# EAGLE schematic Chamber VIP_2 (EAGLE 7.6.0)
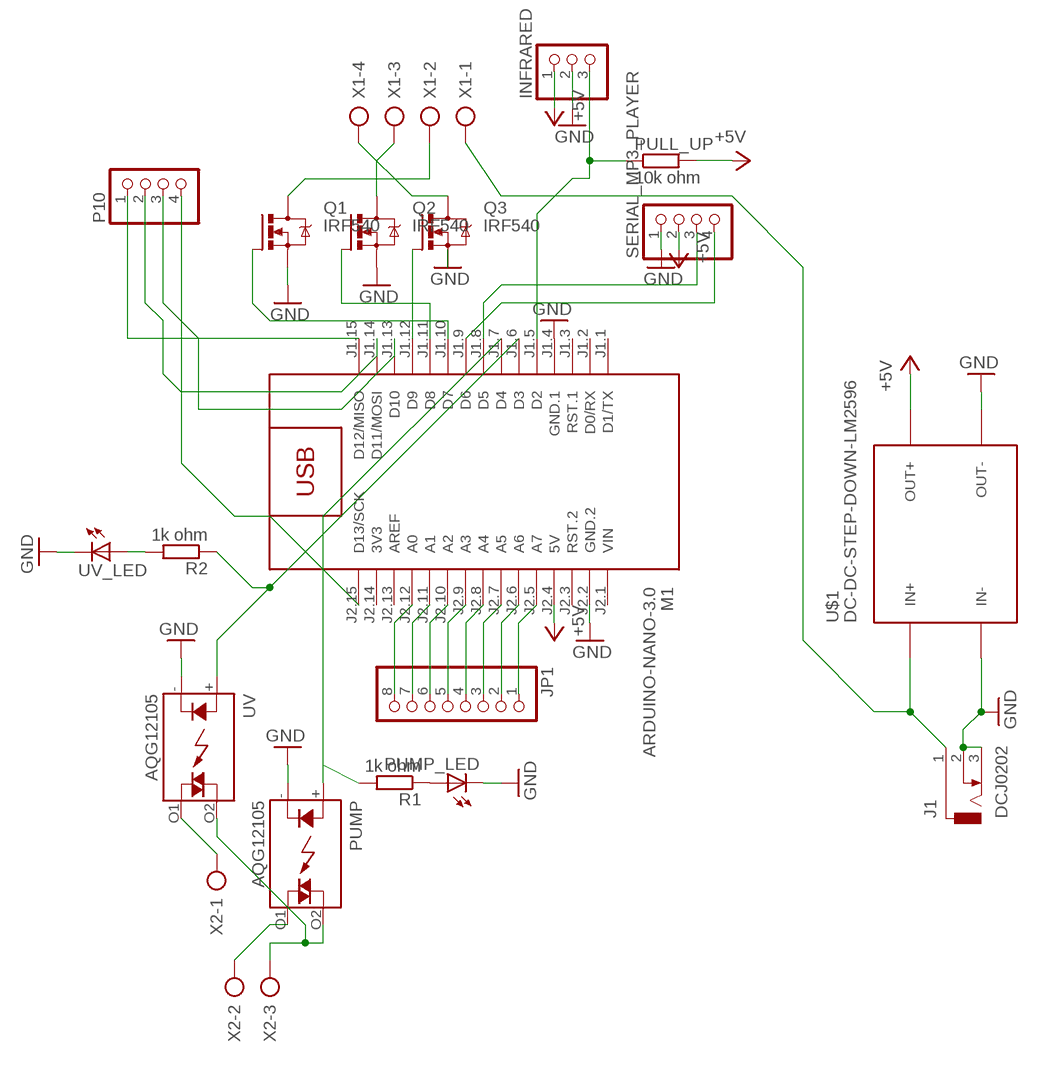
[diagram p0: schematic, sheet 1]

## Parts
INFRARED  PINHD-1X3  [1X03]
J1  DCJ0202  [DCJ0202]
JP1  PINHD-1X8  [1X08]
M1  ARDUINO-NANO-3.0  [ARDUINO-NANO-3.0]
P10  PINHD-1X4  [1X04]
PULL_UP  10k ohm  R-EU_0204/7  [0204/7]
PUMP  AQG12105  [AQG]
PUMP_LED  LED5MM  [LED5MM]
Q1  IRF540  [TO220BV]
Q2  IRF540  [TO220BV]
Q3  IRF540  [TO220BV]
R1  1k ohm  R-EU_0204/7  [0204/7]
R2  1k ohm  R-EU_0204/7  [0204/7]
SERIAL_MP3_PLAYER  PINHD-1X4  [1X04]
U$1  DC-DC-STEP-DOWN-LM2596  [DC-DC-STEP-DOWN-LM2596]
UV  AQG12105  [AQG]
UV_LED  LED5MM  [LED5MM]
X1  AK300/4  [AK300/4]
X2  AK300/3  [AK300/3]

## Nets
+5V: INFRARED.1 M1.J2.4(5V) PULL_UP.2 SERIAL_MP3_PLAYER.2 U$1.OUT+
GND: INFRARED.2 J1.2 J1.3 M1.J1.4(GND.1) M1.J2.2(GND.2) PUMP.-(K) PUMP_LED.K(C) Q1.S Q2.S Q3.S SERIAL_MP3_PLAYER.1 U$1.IN- U$1.OUT- UV.-(K) UV_LED.K(C)
N$1: Q3.D X1.4
N$2: J1.1 U$1.IN+ X1.1
N$3: Q1.D X1.2
N$4: Q2.D X1.3
N$5: JP1.8 M1.J2.12(A0)
N$6: PUMP.O1(DS2) X2.2
N$7: UV.O1(DS2) X2.1
N$8: M1.J1.12(D9) Q3.G
N$9: M1.J1.6(D3) R2.1 UV.+(A)
N$10: M1.J1.10(D7) Q1.G
N$11: M1.J1.11(D8) Q2.G
N$12: M1.J1.9(D6) SERIAL_MP3_PLAYER.4
N$13: INFRARED.3 M1.J1.5(D2) PULL_UP.1
N$14: R2.2 UV_LED.A
N$16: PUMP_LED.A R1.1
N$17: M1.J1.8(D5) SERIAL_MP3_PLAYER.3
N$20: M1.J1.7(D4) PUMP.+(A) R1.2
N$25: M1.J1.15(D12/MISO) P10.1
N$26: M1.J1.14(D11/MOSI) P10.2
N$27: M1.J1.13(D10) P10.3
N$28: M1.J2.15(D13/SCK) P10.4
N$29: PUMP.O2(DS1) UV.O2(DS1) X2.3
N$30: JP1.7 M1.J2.11(A1)
N$31: JP1.6 M1.J2.10(A2)
N$32: JP1.5 M1.J2.9(A3)
N$33: JP1.4 M1.J2.8(A4)
N$34: JP1.3 M1.J2.7(A5)
N$35: JP1.2 M1.J2.6(A6)
N$36: JP1.1 M1.J2.5(A7)
Unconnected: M1.J1.1(D1/TX) M1.J1.2(D0/RX) M1.J1.3(RST.1) M1.J2.3(RST.2) M1.J2.13(AREF)

## Power pins joined to a net without a drawn wire
3V3: M1.J2.14(3V3)
VIN: M1.J2.1(VIN)

## Library data of the parts
INFRARED = pinhead:PINHD-1X3: PIN HEADER
J1 = con-jack:DCJ0202: DC POWER JACK Source: DCJ0202.pdf; OC_FARNELL: unknown; OC_NEWARK: unknown
JP1 = pinhead:PINHD-1X8: PIN HEADER
M1 = diy-modules:ARDUINO-NANO-3.0: Arduino Nano 3.0 and compatible devices More details available here: https://www.arduino.cc/en/Main/ArduinoBoardNano Click here to find device on ebay.com <http://www.ebay.com/sch/arduino+nano>
P10 SERIAL_MP3_PLAYER = pinhead:PINHD-1X4: PIN HEADER
PULL_UP R1 R2 = rcl:R-EU_: RESISTOR, European symbol
PUMP UV = relay:AQG*: SOLID STATE RELAY NAiS Zero-cross, Non zero-cross Source: http://www.mew-europe.com/.. en_ds_61611_0000.pdf; MF: AROMAT/ MATSUSHITA; MPN: AQG12105; OC_FARNELL: unknown; OC_NEWARK: 20J4759
PUMP_LED UV_LED = led:LED: LED OSRAM: - CHIPLED LG R971, LG N971, LY N971, LG Q971, LY Q971, LO R971, LY R971 LH N974, LH R974 LS Q976, LO Q976, LY Q976 LO Q996 - Hyper CHIPLED LW Q18S LB Q993, LB Q99A, LB R99A - SideLED LS A670, LO A670, LY A670, LG A670, LP A670 LB A673, LV A673, LT A673, LW A673 LH A674 LY A675 LS A676, LA A676, LO A676, LY A676, LW A676 LS A679, LY A679, LG A679 - Hyper Micro SIDELED® LS Y876, LA Y876, LO Y876, LY Y876 LT Y87S - SmartLED LW L88C, LW L88S LB L89C, LB L89S, LG L890 LS L89K, LO L89K, LY L89K LS L896, LA L896, LO L896, LY L896 - TOPLED LS T670, LO T670, LY T670, LG T670, LP T670 LSG T670, LSP T670, LSY T670, LOP T670, LYG T670 LG T671, LOG T671, LSG T671 LB T673, LV T673, LT T673, LW T673 LH T674 LS T676, LA T676, LO T676, LY T676, LB T676, LH T676, LSB T676, LW T676 LB T67C, LV T67C, LT T67C, LS T67K, LO T67K, LY T67K, LW E67C LS E67B, LA E67B, LO E67B, LY E67B, LB E67C, LV E67C, LT E67C LW T67C LS T679, LY T679, LG T679 LS T770, LO T770, LY T770, LG T770, LP T770 LB T773, LV T773, LT T773, LW T773 LH T774 LS E675, LA E675, LY E675, LS T675 LS T776, LA T776, LO T776, LY T776, LB T776 LHGB T686 LT T68C, LB T68C - Hyper Mini TOPLED® LB M676 - Mini TOPLED Santana® LG M470 LS M47K, LO M47K, LY M47K Source: http://www.osram.convergy.de LUXEON: - LUMILED® LXK2-PW12-R00, LXK2-PW12-S00, LXK2-PW14-U00, LXK2-PW14-V00 LXK2-PM12-R00, LXK2-PM12-S00, LXK2-PM14-U00 LXK2-PE12-Q00, LXK2-PE12-R00, LXK2-PE12-S00, LXK2-PE14-T00, LXK2-PE14-U00 LXK2-PB12-K00, LXK2-PB12-L00, LXK2-PB12-M00, LXK2-PB14-N00, LXK2-PB14-P00, LXK2-PB14-Q00 LXK2-PR12-L00, LXK2-PR12-M00, LXK2-PR14-Q00, LXK2-PR14-R00 LXK2-PD12-Q00, LXK2-PD12-R00, LXK2-PD12-S00 LXK2-PH12-R00, LXK2-PH12-S00 LXK2-PL12-P00, LXK2-PL12-Q00, LXK2-PL12-R00 Source: www.luxeon.com KINGBRIGHT: KA-3528ASYC Source: www.kingbright.com
Q1-Q3 = transistor-power:IRF540: HEXFET Power MOSFET
U$1 = diy-modules:DC-DC-STEP-DOWN-LM2596: DC/DC Step-Down Regulator based on LM2596-ADJ chip LM2596 datasheet available here: http://www.ti.com/lit/ds/symlink/lm2596.pdf Click here to find device on ebay.com <http://www.ebay.com/sch/lm2596+power+regulator>
X1 = con-ptr500:AK300/4: CONNECTOR; OC_FARNELL: unknown; OC_NEWARK: unknown
X2 = con-ptr500:AK300/3: CONNECTOR; OC_FARNELL: unknown; OC_NEWARK: unknown